# Altium schematic sheet 模拟量.SchDoc: 阿波罗模拟量控制器
size A4; Revision: V1.1; SheetNumber: 0; SheetTotal: 0
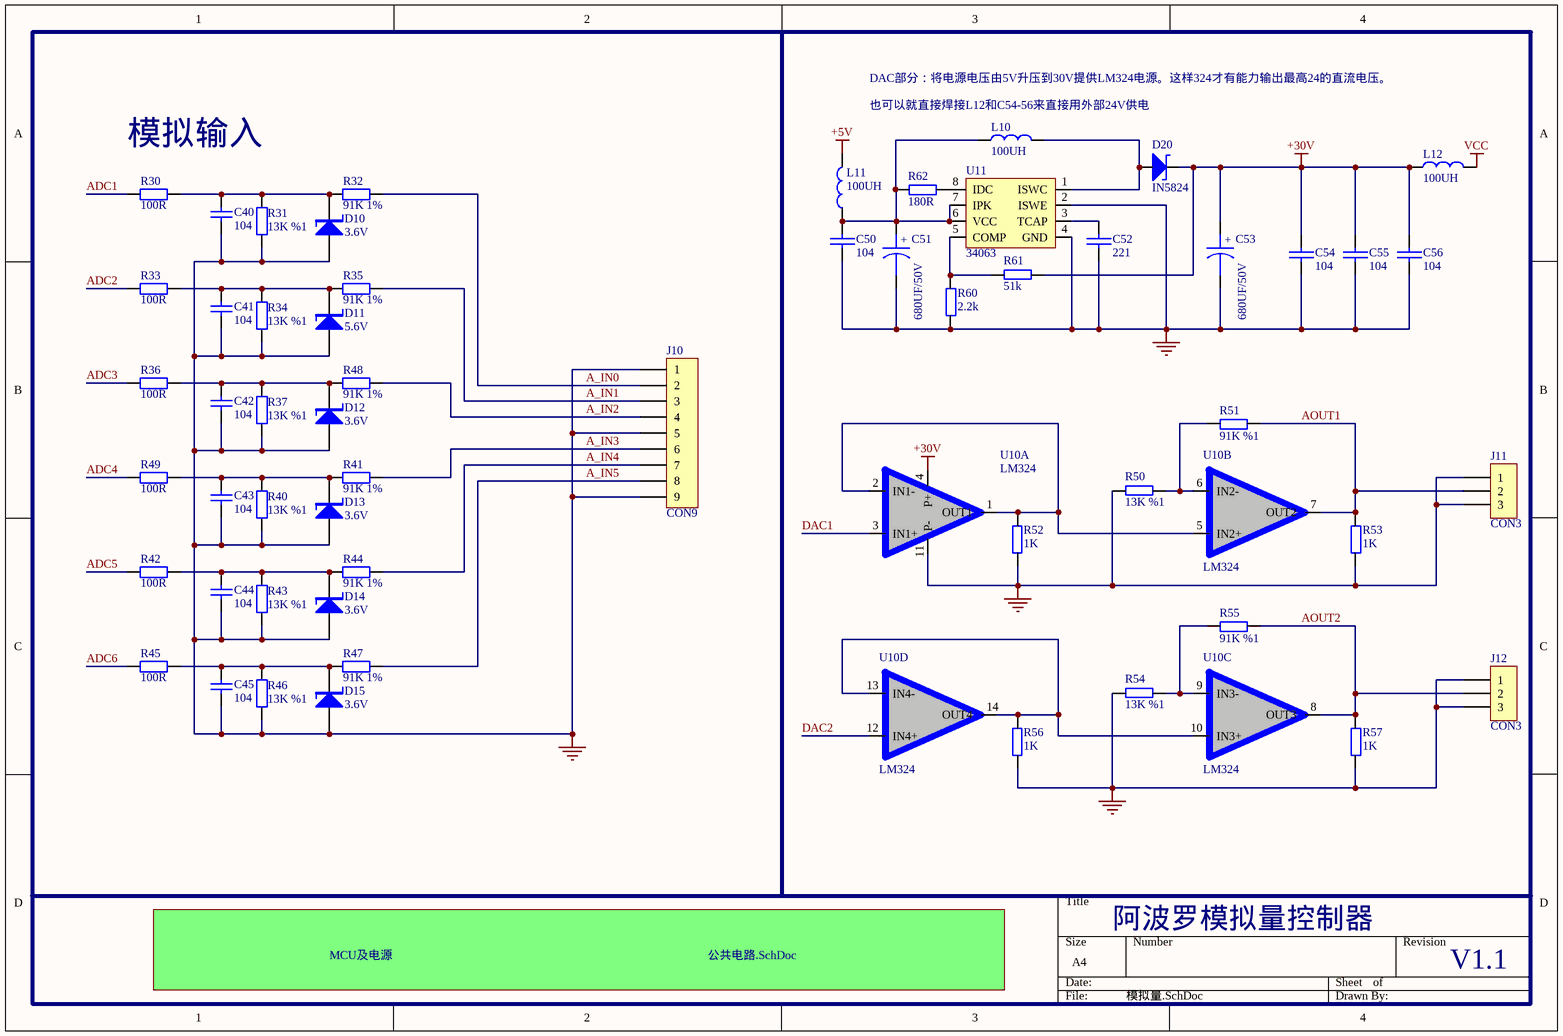
[diagram p0: 模拟量.SchDoc]

## Parts
C40  104  [0603A]
C41  104  [0603A]
C42  104  [0603A]
C43  104  [0603A]
C44  104  [0603A]
C45  104  [0603A]
C50  104  [0603A]
C51  680UF/50V  [电解电容]
C52  221  [0603A]
C53  680UF/50V  [电解电容]
C54  104  [0603A]
C55  104  [0603A]
C56  104  [0603A]
D10  3.6V  [贴片二极管]
D11  5.6V  [贴片二极管]
D12  3.6V  [贴片二极管]
D13  3.6V  [贴片二极管]
D14  3.6V  [贴片二极管]
D15  3.6V  [贴片二极管]
D20  IN5824  [贴片二极管]
J10  CON9  [CON9-5.1卧]
J11  CON3  [CON3-5.1卧]
J12  CON3  [CON3-5.1卧]
L10  100UH  [SMD-50]
L11  100UH  [1206C]
L12  100UH  [1206C]
R30  100R  [0603A]
R31  13K %1  [0603A]
R32  91K 1%  [0603A]
R33  100R  [0603A]
R34  13K %1  [0603A]
R35  91K 1%  [0603A]
R36  100R  [0603A]
R37  13K %1  [0603A]
R40  13K %1  [0603A]
R41  91K 1%  [0603A]
R42  100R  [0603A]
R43  13K %1  [0603A]
R44  91K 1%  [0603A]
R45  100R  [0603A]
R46  13K %1  [0603A]
R47  91K 1%  [0603A]
R48  91K 1%  [0603A]
R49  100R  [0603A]
R50  13K %1  [0603A]
R51  91K %1  [0603A]
R52  1K  [0603A]
R53  1K  [0603A]
R54  13K %1  [0603A]
R55  91K %1  [0603A]
R56  1K  [0603A]
R57  1K  [0603A]
R60  2.2k  [0603A]
R61  51k  [0603A]
R62  180R  [0603A]
U10  LM324  [SO-14]  (parts A,B,C,D of 4)
U11  34063  [SO8_L]

## Sub-sheets
MCU及电源 = 公共电路.SchDoc: no entries

## Nets
+5V: L11.1
+30V: C53.1 C54.1 C55.1 C56.1 D20.K L12.2 R61.1 U10.4(P+)
GND: C40.1 C41.1 C42.1 C43.1 C44.1 C45.1 C50.2 C51.2 C52.2 C53.2 C54.2 C55.2 C56.2 D10.A D11.A D12.A D13.A D14.A D15.A J10.1 J10.5 J10.9 J11.1 J11.3 J12.1 J12.3 R31.1 R34.1 R37.1 R40.1 R43.1 R46.1 R50.2 R52.2 R53.1 R54.2 R56.2 R57.1 R60.1 U10.11(P-) U11.2(ISWE) U11.4(GND)
VCC: L12.1
A_IN0: J10.2 R32.1
A_IN1: J10.3 R35.1
A_IN2: J10.4 R48.1
A_IN3: J10.6 R41.1
A_IN4: J10.7 R44.1
A_IN5: J10.8 R47.1
ADC1: R30.1
ADC2: R33.1
ADC3: R36.1
ADC4: R49.1
ADC5: R42.1
ADC6: R45.1
AOUT1: J11.2 R51.2 R53.2 U10.7(OUT2)
AOUT2: J12.2 R55.2 R57.2 U10.8(OUT3)
DAC1: U10.3(IN1+)
DAC2: U10.12(IN4+)
NetC40_2: C40.2 D10.K R30.2 R31.2 R32.2
NetC41_2: C41.2 D11.K R33.2 R34.2 R35.2
NetC42_2: C42.2 D12.K R36.2 R37.2 R48.2
NetC43_2: C43.2 D13.K R40.2 R41.2 R49.2
NetC44_2: C44.2 D14.K R42.2 R43.2 R44.2
NetC45_2: C45.2 D15.K R45.2 R46.2 R47.2
NetC50_1: C50.1 C51.1 L10.2 L11.2 R62.1 U11.6(VCC) U11.7(IPK)
NetC52_1: C52.1 U11.3(TCAP)
NetD20_A: D20.A L10.1 U11.1(ISWC)
NetR50_1: R50.1 R51.1 U10.6(IN2-)
NetR52_1: R52.1 U10.1(OUT1) U10.2(IN1-) U10.5(IN2+)
NetR54_1: R54.1 R55.1 U10.9(IN3-)
NetR56_1: R56.1 U10.10(IN3+) U10.13(IN4-) U10.14(OUT4)
NetR60_2: R60.2 R61.2 U11.5(COMP)
NetR62_2: R62.2 U11.8(IDC)

## Notes on the sheet
- DAC部分：将电源电压由5V升压到30V提供LM324电源。这样324才有能力输出最高24的直流电压。
- (near L10) 也可以就直接焊接L12和C54-56来直接用外部24V供电
- 模拟输入
- (in symbol CAPACITOR POL) +

## Library data of the parts
C40-C45 = Cap_1: Capacitor; Value: 100pF; Published: 8-Jun-2000; LatestRevisionDate: 17-Jul-2002; LatestRevisionNote: Re-released for DXP Platform.; PackageReference: RAD-0.3; Publisher: Altium Limited
C50 C52 C54-C56 = CAP: Capacitor
C51 C53 = CAPACITOR POL: Capacitor
D10-D15 = 稳压二极管
D20 = 肖特基二极管
L10-L12 = L1
R30-R37 R40-R49 = Res2: Resistor; Value: 1K; Published: 8-Jun-2000; LatestRevisionDate: 17-Jul-2002; LatestRevisionNote: Re-released for DXP Platform.; PackageReference: AXIAL-0.4; Publisher: Altium Limited
R50-R57 R60-R62 = R